# EasyEDA schematic EasyEDA_UNO_SHIELD_V1_Schematic.json
TITLE: ATTinyX5 Uno Shield; REV: 1.0; Date: 2020-09-03; Sheet: 1/1; Drawn By: Devin Watson; Company: Braining
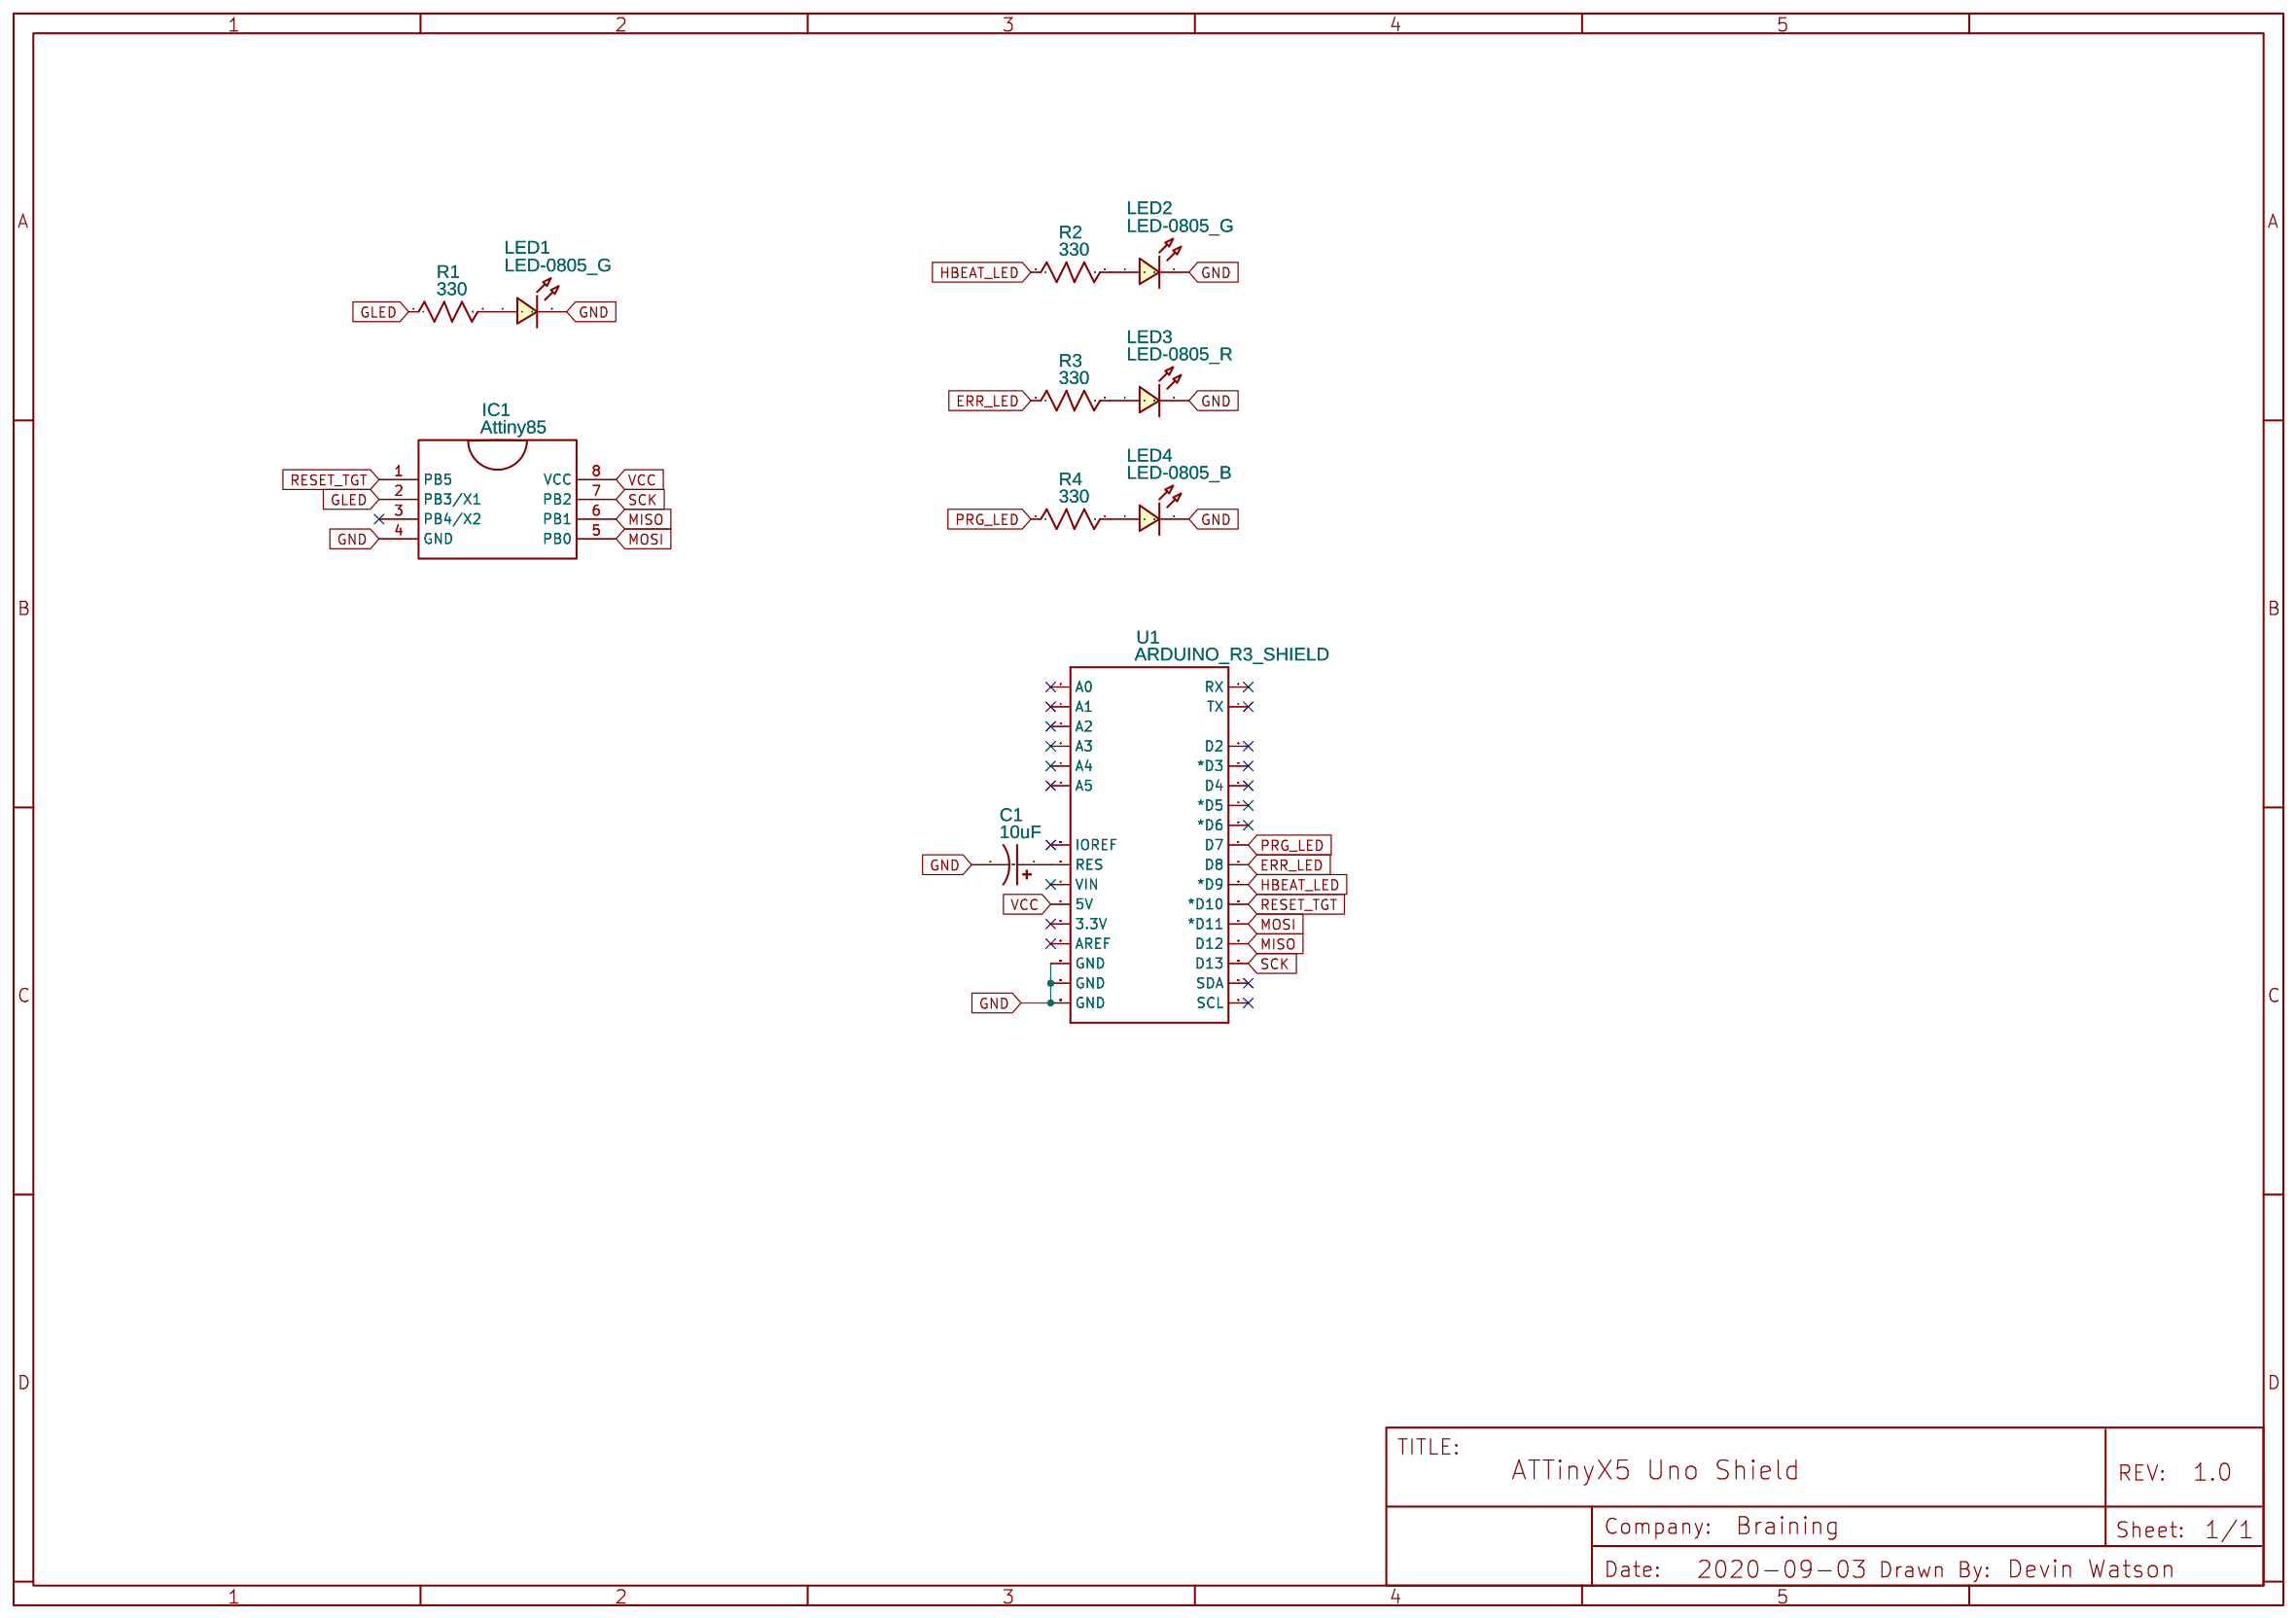
[diagram p0: schematic sheet]

## Parts
C1  10uF  [CAP-D4.0×H5.5]
IC1  Attiny85  [DIP8]
LED1  LED-0805_G  [LED0805_GREEN]
LED2  LED-0805_G  [LED0805_GREEN]
LED3  LED-0805_R  [LED0805_RED]
LED4  LED-0805_B  [LED0805_BLUE]
R1  330  [R0805]
R2  330  [R0805]
R3  330  [R0805]
R4  330  [R0805]
U1  ARDUINO_R3_SHIELD  [UNO_R3_SHIELD_NOLABELS]

## Library data of the parts
C1 = CE_SMD_D4.0×H5.5_US: Supplier Part: 667-EEE-HP0J100R; Supplier: Mouser; Contributor: LCEDA_Lib; Manufacturer Part: EEE-HP0J100R; Manufacturer: Panasonic
IC1 = Attiny85: Contributor: Nuros
LED1 LED2 = LED-0805_G: Manufacturer: Everlight; Manufacturer Part: 17-21SYGC/S530-E2/TR8; Supplier Part: 638-1721SYGCS530E2; Supplier: Mouser; Contributor: LCEDA_Lib
LED3 = LED-0805_R: Manufacturer: EVERLIGHT(台湾亿光); Manufacturer Part: EL-12-215SURC/S530-A2/TR8; Supplier Part: 638-215SURCS530A28; Supplier: Mouser; Contributor: LCEDA_Lib
LED4 = LED-0805_B: Manufacturer: Lite-On; Manufacturer Part: LTST-C170TBKT; Supplier Part: 859-LTST-C170TBKT; Supplier: Mouser; Contributor: LCEDA_Lib
R1-R4 = R_0805_US: Supplier Part: 71-CRCW0805330RJNEAC; Supplier: Mouser; Contributor: LCEDA_Lib; Manufacturer Part: CRCW0805330RJNEAC; Manufacturer: Vishay/Dale
U1 = ARDUINO_R3_SHIELD: Contributor: SparkFun

## Nets
GND: C1.2 IC1.4(GND) LED1.2 LED2.2 LED3.2 LED4.2 U1.GND@0(GND) U1.GND@1(GND) U1.GND@2(GND)
VCC: IC1.8(VCC) U1.5V
ERR_LED: R3.1 U1.D8
GLED: IC1.2(PB3/X1) R1.1
HBEAT_LED: R2.1 U1.D9(*D9)
MISO: IC1.6(PB1) U1.D12
MOSI: IC1.5(PB0) U1.D11(*D11)
PRG_LED: R4.1 U1.D7
RESET_TGT: IC1.1(PB5) U1.D10(*D10)
SCK: IC1.7(PB2) U1.D13
Net-(C1-1): C1.1 U1.RES
Net-(LED1-1): LED1.1 R1.2
Net-(LED2-1): LED2.1 R2.2
Net-(LED3-1): LED3.1 R3.2
Net-(LED4-1): LED4.1 R4.2

Not connected (* = marked no-connect by the designer): IC1 3(PB4/X2)*; U1 3.3V* A0* A1* A2* A3* A4* A5* AREF* D2* D3(*D3)* D4* D5(*D5)* D6(*D6)* IOREF* RX* SCL* SDA* TX* VIN*
